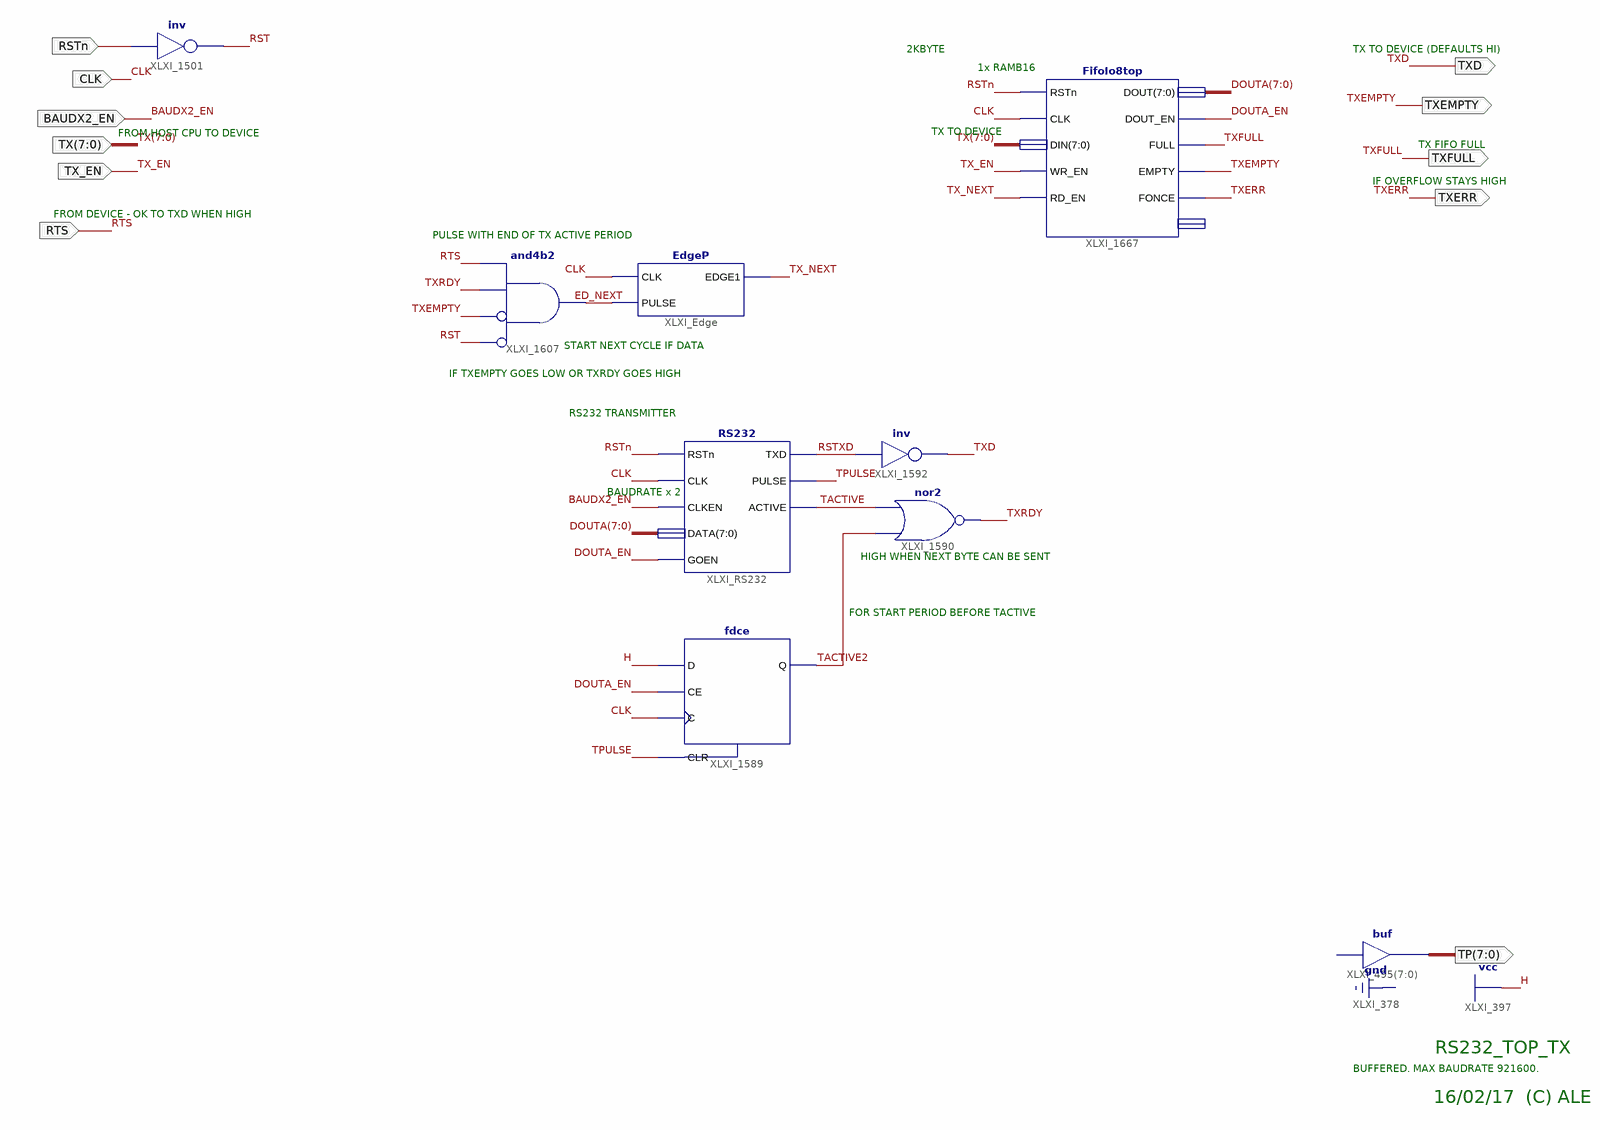
[diagram p0: schematic sheet 1]
// Xilinx ISE schematic RS232_TOP_TX.sch (spartan3e) as structural Verilog: 9 symbols, 11 ports
module RS232_TOP_TX (
  input  CLK,
  input  RSTn,
  input  [7:0] TX,
  input  TX_EN,
  input  RTS,
  input  BAUDX2_EN,
  output TXD,
  output TXEMPTY,
  output TXERR,
  output [7:0] TP,
  output TXFULL
);

  wire DOUTA_EN, ED_NEXT, RST, RSTXD, TACTIVE, TACTIVE2, TPULSE, TX_NEXT, TXRDY;
  wire [7:0] DOUTA;

  not XLXI_1501 (RST, RSTn);
  EdgeP XLXI_Edge (.CLK(CLK), .EDGE1(TX_NEXT), .PULSE(ED_NEXT));
  and XLXI_1607 (ED_NEXT, ~RST, ~TXEMPTY, TXRDY, RTS);  // and4b2
  // buf XLXI_495[7..0] has open pins: I=open, O=TP
  nor XLXI_1590 (TXRDY, TACTIVE2, TACTIVE);
  not XLXI_1592 (TXD, RSTXD);
  fdce XLXI_1589 (.C(CLK), .CE(DOUTA_EN), .CLR(TPULSE), .D(1'b1), .Q(TACTIVE2));
  RS232 XLXI_RS232 (
    .ACTIVE(TACTIVE), .CLK(CLK), .CLKEN(BAUDX2_EN), .DATA(DOUTA), .GOEN(DOUTA_EN), .PULSE(TPULSE),
    .RSTn(RSTn), .TXD(RSTXD));
  FifoIo8top XLXI_1667 (
    .CLK(CLK), .DIN(TX), .DOUT(DOUTA), .DOUT_EN(DOUTA_EN), .EMPTY(TXEMPTY), .FONCE(TXERR), .FULL(TXFULL),
    .RD_EN(TX_NEXT), .RSTn(RSTn), .WR_EN(TX_EN));  // open: TP

  // Notes on the sheet:
  //   2KBYTE
  //   TX TO DEVICE (DEFAULTS HI)
  //   1x RAMB16
  //   TX TO DEVICE
  //   FROM HOST CPU TO DEVICE
  //   TX FIFO FULL
  //   IF OVERFLOW STAYS HIGH
  //   FROM DEVICE - OK TO TXD WHEN HIGH
  //   PULSE WITH END OF TX ACTIVE PERIOD
  //   START NEXT CYCLE IF DATA
  //   IF TXEMPTY GOES LOW OR TXRDY GOES HIGH
  //   RS232 TRANSMITTER
  //   BAUDRATE x 2
  //   HIGH WHEN NEXT BYTE CAN BE SENT
  //   FOR START PERIOD BEFORE TACTIVE
  //   RS232_TOP_TX
  //   BUFFERED. MAX BAUDRATE 921600.
  //   16/02/17  (C) ALE
endmodule
